# EAGLE schematic as-schematic (EAGLE 7.1.0)
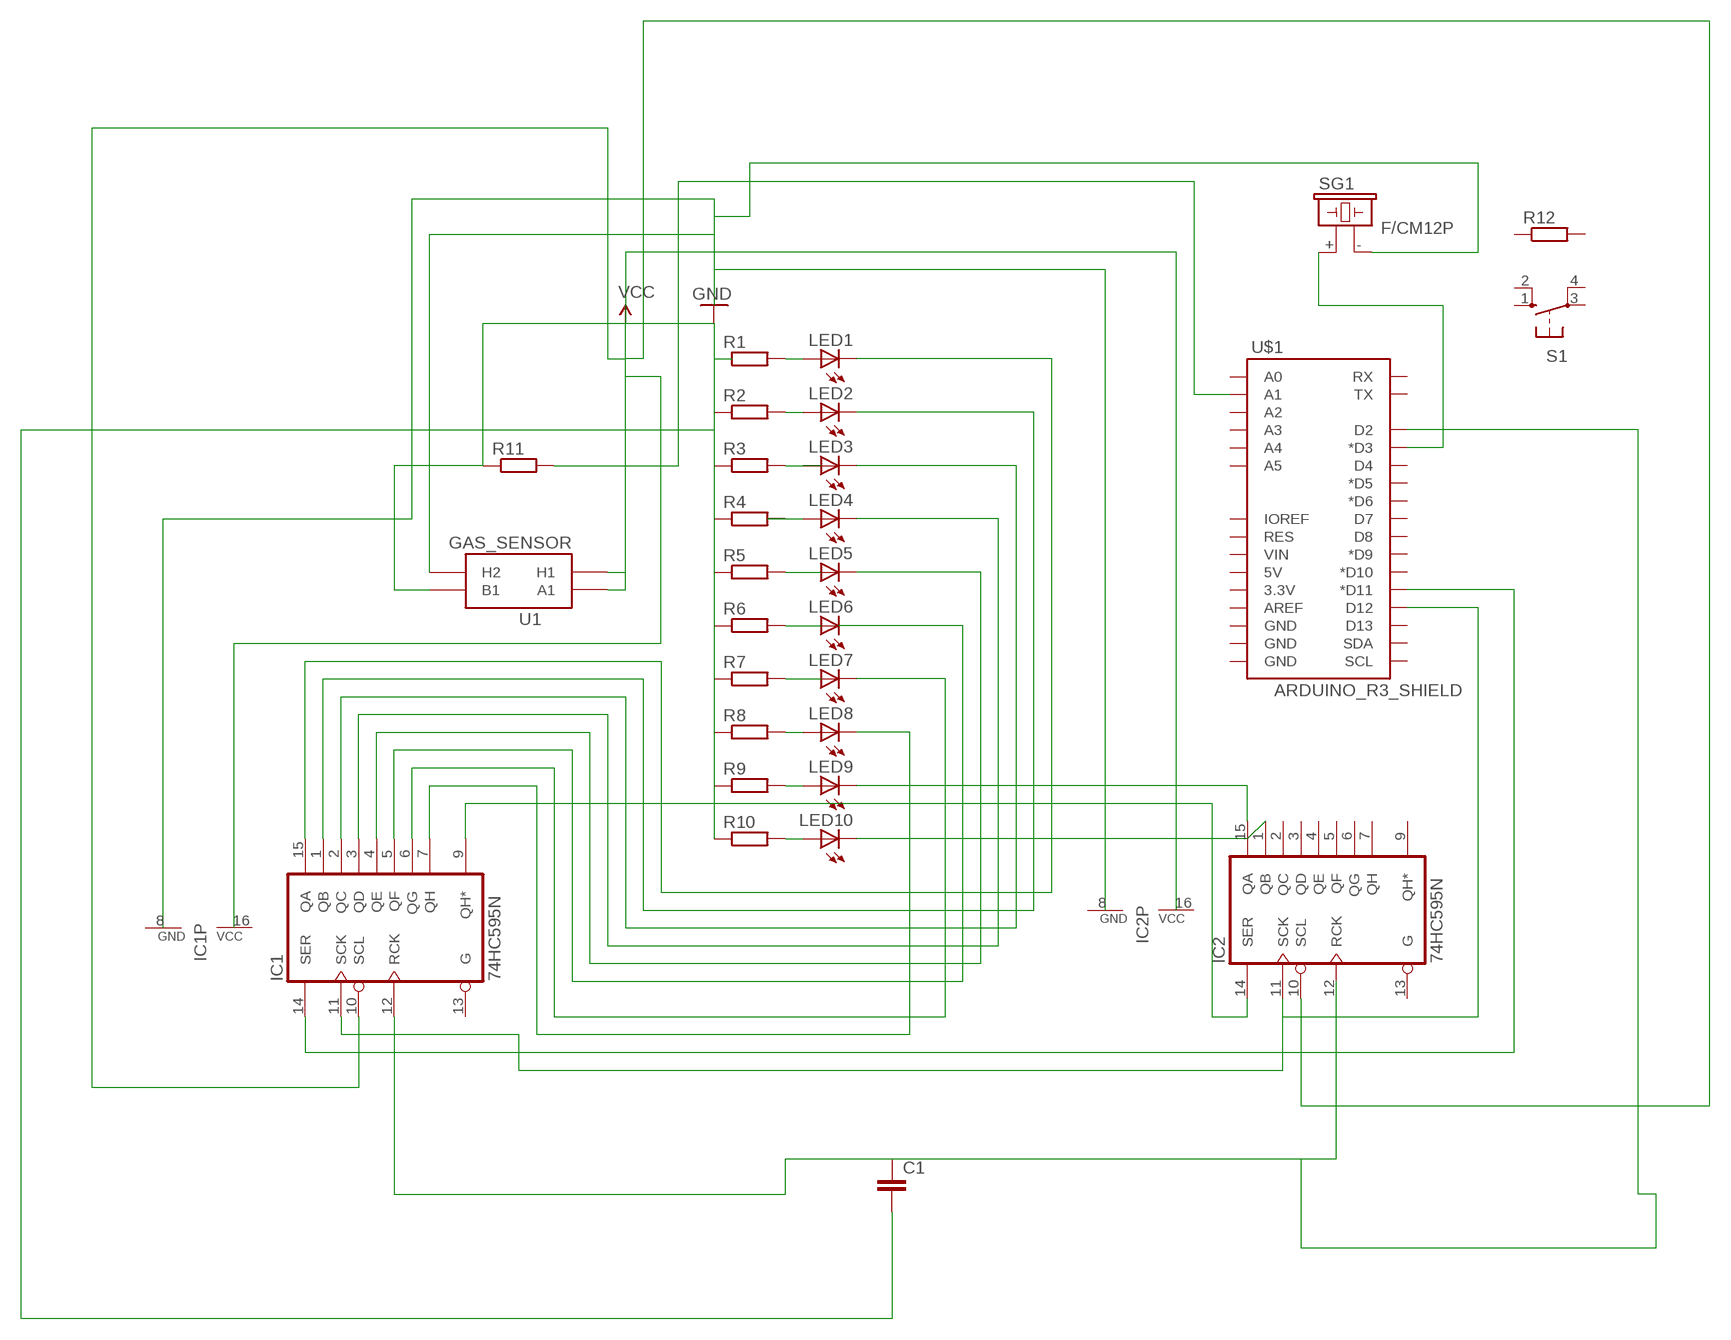
[diagram p0: schematic, sheet 1]

## Parts
C1  C-EU025-025X050  [C025-025X050]
IC1  74HC595N  [DIL16]
IC2  74HC595N  [DIL16]
LED1  LED5MM  [LED5MM]
LED2  LED5MM  [LED5MM]
LED3  LED5MM  [LED5MM]
LED4  LED5MM  [LED5MM]
LED5  LED5MM  [LED5MM]
LED6  LED5MM  [LED5MM]
LED7  LED5MM  [LED5MM]
LED8  LED5MM  [LED5MM]
LED9  LED5MM  [LED5MM]
LED10  LED5MM  [LED5MM]
R1  R-EU_0207/10  [0207/10]
R2  R-EU_0207/10  [0207/10]
R3  R-EU_0207/10  [0207/10]
R4  R-EU_0207/10  [0207/10]
R5  R-EU_0207/10  [0207/10]
R6  R-EU_0207/10  [0207/10]
R7  R-EU_0207/10  [0207/10]
R8  R-EU_0207/10  [0207/10]
R9  R-EU_0207/10  [0207/10]
R10  R-EU_0207/10  [0207/10]
R11  R-EU_0207/10  [0207/10]
R12  R-EU_0207/10  [0207/10]
S1  40-XX  [B3F-40XX]
SG1  F/CM12P  [F/CM12P]
U1  GAS_SENSOR  [MQ-3]
U$1  ARDUINO_R3_SHIELD  [UNO_R3_SHIELD]

## Nets
GND: C1.2 R1.1 R2.1 R3.1 R4.1 R5.1 R6.1 R7.1 R9.1 R10.1 R11.1 U1.B1
N$1: LED1.A R1.2
N$2: LED2.A R2.2
N$3: R3.2
N$4: LED4.A
N$5: R5.2
N$6: R6.2
N$7: R7.2
N$8: LED8.A R8.2
N$9: LED9.A R9.2
N$10: LED10.A R10.2
N$11: SG1.- U1.HB(H2)
N$12: IC1.15(QA) LED1.K(C)
N$13: IC1.1(QB) LED2.K(C)
N$14: IC1.2(QC) LED3.K(C)
N$15: IC1.3(QD) LED4.K(C)
N$16: IC1.4(QE) LED5.K(C)
N$17: IC1.5(QF)
N$18: IC1.6(QG) LED7.K(C)
N$19: IC1.7(QH) LED8.K(C)
N$20: IC2.15(QA) LED9.K(C)
N$21: IC2.1(QB) LED10.K(C)
N$22: C1.1 IC1.12(RCK) U$1.D2
N$23: R11.2 U$1.A1
N$24: SG1.+ U$1.D3(*D3)
N$26: IC1.14(SER) U$1.D11(*D11)
N$27: IC1.9(QH*) IC2.14(SER)
N$28: IC1.11(SCK) IC2.11(SCK) U$1.D12
VCC: IC1.10(SCL) IC2.10(SCL) U1.A1 U1.HA(H1)
Unconnected: IC1.13(G) IC2.2(QC) IC2.3(QD) IC2.4(QE) IC2.5(QF) IC2.6(QG) IC2.7(QH) IC2.9(QH*) IC2.12(RCK) IC2.13(G) LED3.A LED5.A LED6.A LED6.K(C) LED7.A R4.2 R8.1 R12.1 R12.2 S1.1(S) S1.2(S1) S1.3(P) S1.4(P1) U$1.3.3V U$1.5V U$1.A0 U$1.A2 U$1.A3 U$1.A4 U$1.A5 U$1.AREF U$1.D4 U$1.D5(*D5) U$1.D6(*D6) U$1.D7 U$1.D8 U$1.D9(*D9) U$1.D10(*D10) U$1.D13 U$1.GND@0(GND) U$1.GND@1(GND) U$1.GND@2(GND) U$1.IOREF U$1.RES U$1.RX U$1.SCL U$1.SDA U$1.TX U$1.VIN

## Power pins joined to a net without a drawn wire
GND: IC1.8(GND) IC2.8(GND)
VCC: IC1.16(VCC) IC2.16(VCC)

## Library data of the parts
C1 = rcl:C-EU: CAPACITOR, European symbol
IC1 IC2 = 74xx-eu:74*595: 8-bit SHIFT REGISTER, output latch
LED1-LED10 = adafruit:LED: LED OSRAM: - CHIPLED LG R971, LG N971, LY N971, LG Q971, LY Q971, LO R971, LY R971 LH N974, LH R974 LS Q976, LO Q976, LY Q976 LO Q996 - Hyper CHIPLED LW Q18S LB Q993, LB Q99A, LB R99A - SideLED LS A670, LO A670, LY A670, LG A670, LP A670 LB A673, LV A673, LT A673, LW A673 LH A674 LY A675 LS A676, LA A676, LO A676, LY A676, LW A676 LS A679, LY A679, LG A679 - Hyper Micro SIDELED® LS Y876, LA Y876, LO Y876, LY Y876 LT Y87S - SmartLED LW L88C, LW L88S LB L89C, LB L89S, LG L890 LS L89K, LO L89K, LY L89K LS L896, LA L896, LO L896, LY L896 - TOPLED LS T670, LO T670, LY T670, LG T670, LP T670 LSG T670, LSP T670, LSY T670, LOP T670, LYG T670 LG T671, LOG T671, LSG T671 LB T673, LV T673, LT T673, LW T673 LH T674 LS T676, LA T676, LO T676, LY T676, LB T676, LH T676, LSB T676, LW T676 LB T67C, LV T67C, LT T67C, LS T67K, LO T67K, LY T67K, LW E67C LS E67B, LA E67B, LO E67B, LY E67B, LB E67C, LV E67C, LT E67C LW T67C LS T679, LY T679, LG T679 LS T770, LO T770, LY T770, LG T770, LP T770 LB T773, LV T773, LT T773, LW T773 LH T774 LS E675, LA E675, LY E675, LS T675 LS T776, LA T776, LO T776, LY T776, LB T776 LHGB T686 LT T68C, LB T68C - Hyper Mini TOPLED® LB M676 - Mini TOPLED Santana® LG M470 LS M47K, LO M47K, LY M47K Source: http://www.osram.convergy.de/
R1-R12 = rcl:R-EU_: RESISTOR, European symbol
S1 = switch-omron:40-XX: OMRON SWITCH; MF: OMRON COMPONENTS USA; MPN: B3F-4000; OC_FARNELL: 176434; OC_NEWARK: 36K3105
SG1 = buzzer:F/CM12P: BUZZER Source: Buerklin; OC_FARNELL: unknown; OC_NEWARK: unknown
U1 = SparkFun-Sensors:GAS_SENSOR: MQ-3 alcohol gas sensor . FP not tested. SEN-08880.
U$1 = SparkFun-Boards:ARDUINO_R3_SHIELD: Shield form compatible with the Arduino Uno R3.